# EAGLE schematic bootloader1 (EAGLE 9.6.2)
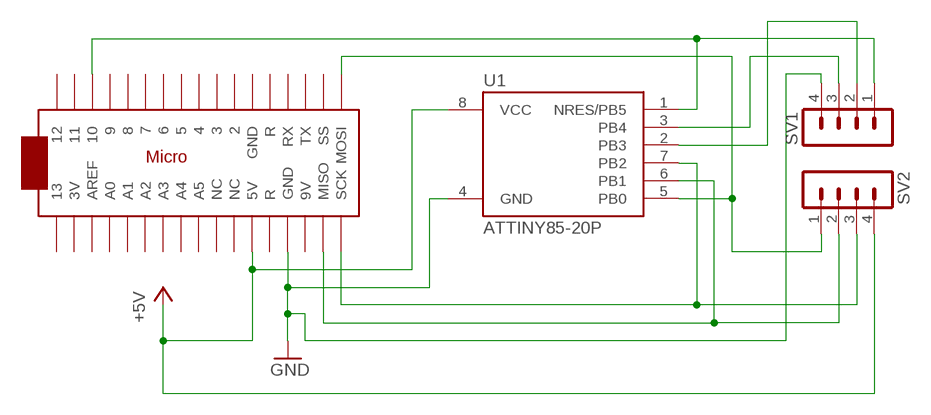
[diagram p0: schematic, sheet 1]

## Parts
SV1  PINHEAD-MA04-1  [PINHEAD-MA04-1]
SV2  PINHEAD-MA04-1  [PINHEAD-MA04-1]
U1  ATTINY85-20P  [PDIP08_300MIL]
U$1  ARDUINOMICRO  [ARDUINOMICRO]

## Nets
+5V: SV2.4 U1.8(VCC) U$1.P$23(5V)
GND: SV1.4 U1.4(GND) U$1.P$12(GND)
N$3: SV1.1 U1.1(NRES/PB5) U$1.P$3
N$4: SV2.3 U1.7(PB2) U$1.P$18(SCK)
N$5: SV2.2 U1.6(PB1) U$1.P$19(MISO)
N$6: SV2.1 U1.5(PB0) U$1.P$17(MOSI)
N$8: SV1.3 U1.3(PB4)
N$9: SV1.2 U1.2(PB3)
Unconnected: U$1.P$1 U$1.P$2 U$1.P$4 U$1.P$5 U$1.P$6 U$1.P$7 U$1.P$8 U$1.P$9 U$1.P$10 U$1.P$11 U$1.P$13(R) U$1.P$14(RX) U$1.P$15(TX) U$1.P$16(SS) U$1.P$20(9V) U$1.P$21(GND) U$1.P$22(R) U$1.P$24(NC) U$1.P$25(NC) U$1.P$26(A5) U$1.P$27(A4) U$1.P$28(A3) U$1.P$29(A2) U$1.P$30(A1) U$1.P$31(A0) U$1.P$32(AREF) U$1.P$33(3V) U$1.P$34

## Library data of the parts
SV1 SV2 = ytani1:PINHEAD-MA04-1: PIN HEADER; OC_FARNELL: unknown; OC_NEWARK: unknown
U1 = _hhn_attiny25_45_85:ATTINY85*: ATMEL ATtiny 85 Packages: P = PDIP 08 30mil S = SOIC 08 EIAJ 208mil Technologies Note: for complete ordering code (temp. range, finish, tape&reel etc.) see www.atmel.com • Supply Voltage: V = (1.8…5.5)V | [blank] = (2.7…5.5)V • Speed: 10 = 10 MHz | 20 = 20 MHz Author: Dipl.-Ing. FH Rainer Bayer HHN Hochschule Heilbronn (Heilbronn University), rainer.bayer@hs-heilbronn.de Ingenieurbüro ing-rb, mail@ing-rb.de
U$1 = adafruit:ARDUINOMICRO